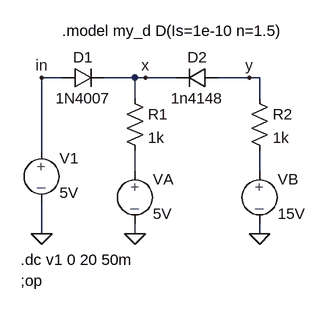
[diagram p0: schematic 2-dioden-schaltung.asc]
2-dioden-schaltung.asc, the LTspice schematic file:
Version 4
SHEET 1 880 680
WIRE 112 160 80 160
WIRE 224 160 176 160
WIRE 240 160 224 160
WIRE 288 160 240 160
WIRE 400 160 352 160
WIRE 416 160 400 160
WIRE 224 192 224 160
WIRE 416 192 416 160
WIRE 80 272 80 160
WIRE 224 304 224 272
WIRE 416 304 416 272
WIRE 80 400 80 352
WIRE 224 400 224 384
WIRE 416 400 416 384
FLAG 416 400 0
FLAG 80 400 0
FLAG 240 160 x
FLAG 400 160 y
FLAG 80 160 in
FLAG 224 400 0
SYMBOL diode 352 144 R90
WINDOW 0 0 32 VBottom 2
WINDOW 3 32 32 VTop 2
SYMATTR InstName D2
SYMATTR Value 1n4148
SYMBOL diode 112 176 R270
WINDOW 0 32 32 VTop 2
WINDOW 3 0 32 VBottom 2
SYMATTR InstName D1
SYMATTR Value 1N4007
SYMBOL res 208 176 R0
SYMATTR InstName R1
SYMATTR Value 1k
SYMBOL res 400 176 R0
SYMATTR InstName R2
SYMATTR Value 1k
SYMBOL source-V 224 288 R0
SYMATTR InstName VA
SYMATTR Value 5V
SYMBOL source-V 416 288 R0
SYMATTR InstName VB
SYMATTR Value 15V
SYMBOL source-V 80 256 R0
SYMATTR InstName V1
SYMATTR Value 5V
TEXT 48 472 Left 2 !;op
TEXT 48 440 Left 2 !.dc v1 0 20 50m
TEXT 112 88 Left 2 !.model my_d D(Is=1e-10 n=1.5)

The netlist it stands for:
* 2-dioden-schaltung.asc
D2 y x 1n4148
D1 in x 1N4007
R1 x N001 1k
R2 y N002 1k
VA N001 0 5V
VB N002 0 15V
V1 in 0 5V
.model D D
.lib standard.dio
;op
.dc v1 0 20 50m
.model my_d D(Is=1e-10 n=1.5)
.backanno
.end